# Altium schematic sheet Schem.SchDoc
size A2; SheetNumber: 1; SheetTotal: 1; SPICEModelCacheNIXBEUAC: <root> / <DocumentId>NIXBEUAC</DocumentId> / </root>
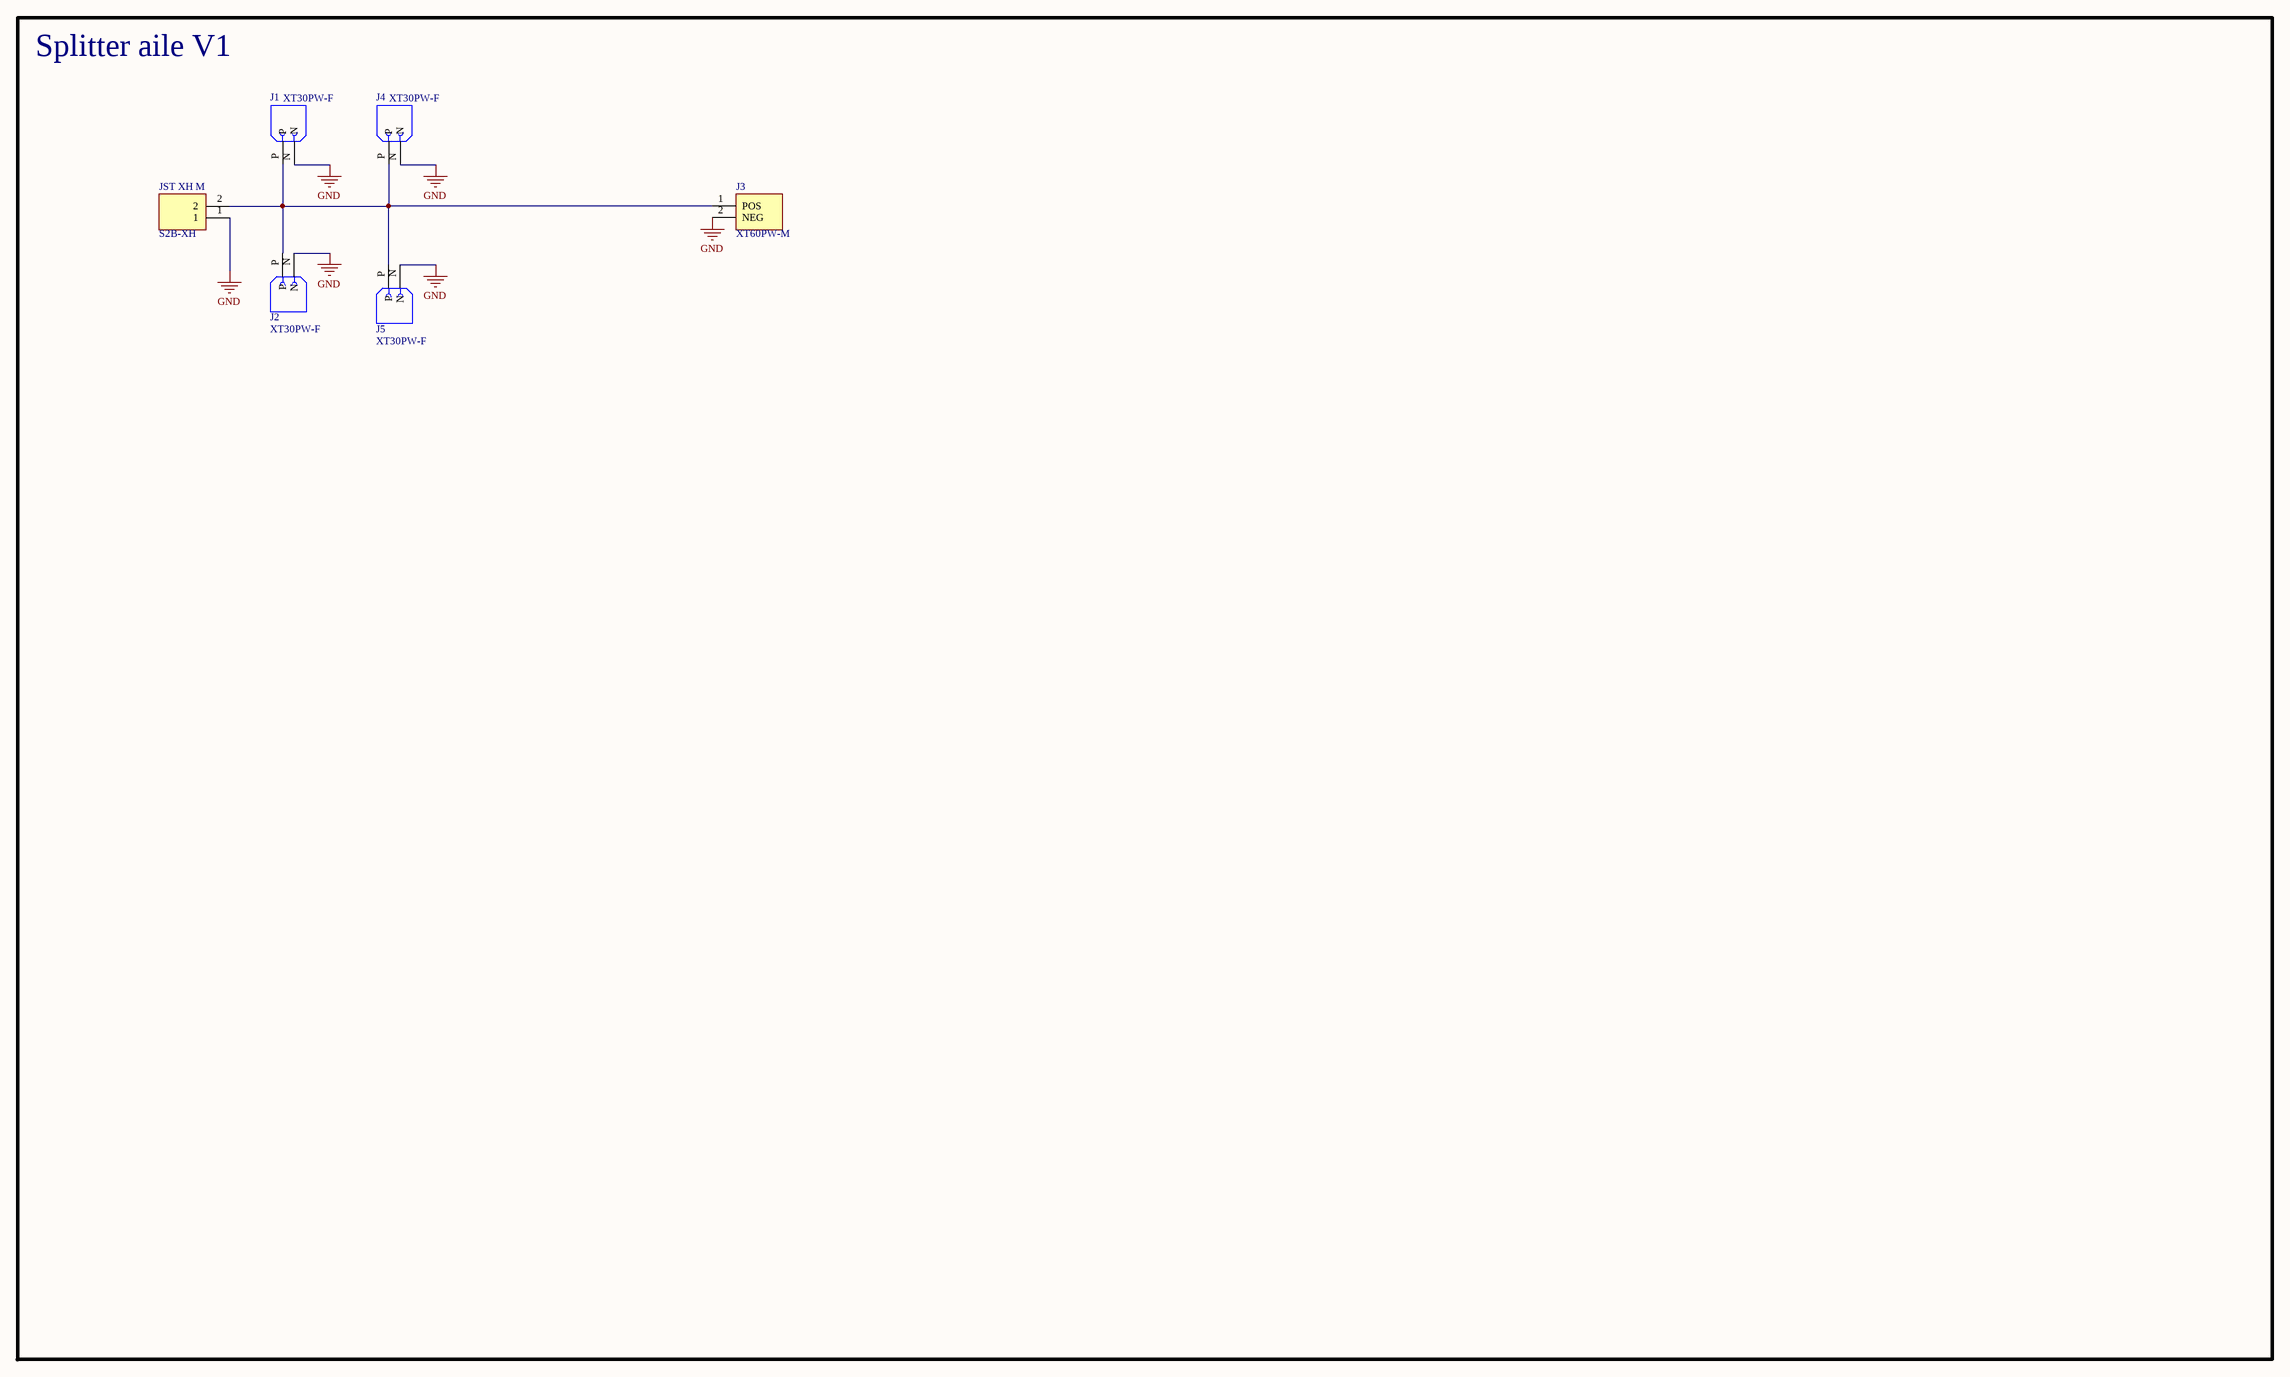
[diagram p0: Schem.SchDoc]

## Parts
J1  XT30PW-F  [AMASS_XT30PW-F]
J2  XT30PW-F  [AMASS_XT30PW-F]
J3  XT60PW-M  [AMASS_XT60PW-M]
J4  XT30PW-F  [AMASS_XT30PW-F]
J5  XT30PW-F  [AMASS_XT30PW-F]
JST_XH_M  S2B-XH  [S2BXHA1LFSN]

## Blocks framed on the sheet
Splitter aile V1: J1-J5 JST_XH_M

## Nets
GND: J1.N J2.N J3.2(NEG) J4.N J5.N JST_XH_M.1
NetJ1_P: J1.P J2.P J3.1(POS) J4.P J5.P JST_XH_M.2

## Library data of the parts
J1 J2 J4 J5 = XT30PW-F: Socket; DC supply; XT30; female; PIN: 2; on PCBs; THT; yellow; 15A; MF: amass; SnapEDA_Link: https://www.snapeda.com/parts/XT30PW-F/AMASS/view-part/?ref=snap; Package: None; Value: *; MP: XT30PW-F; Check_prices: https://www.snapeda.com/parts/XT30PW-F/AMASS/view-part/?ref=eda
J3 = XT60PW-M: Socket, DC supply, male, PIN: 2; MF: AMASS; Check_prices: https://www.snapeda.com/parts/XT60PW-M/AMASS/view-part/?ref=eda; SnapEDA_Link: https://www.snapeda.com/parts/XT60PW-M/AMASS/view-part/?ref=snap; Price: None; Availability: Not in stock; Package: Package; MP: XT60PW-M; Value: *
JST_XH_M = S2B-XH-A-1_LF__SN_: horizontal 2 pin; Manufacturer_Name: JST (JAPAN SOLDERLESS TERMINALS); Manufacturer_Part_Number: S2B-XH-A-1(LF)(SN); Datasheet Link: http://www.jst-mfg.com/product/pdf/eng/eXH.pdf; Height: 6.1mm; Mouser Part Number: 306-S2BXHA1LFSN; Mouser Price/Stock: https://www.mouser.co.uk/ProductDetail/JST-Commercial/S2B-XH-A-1LFSN?qs=QpmGXVUTftHhNeC%252BPQWeTw%3D%3D